# Altium schematic sheet TTL_TO_RS232.SchDoc
size A4
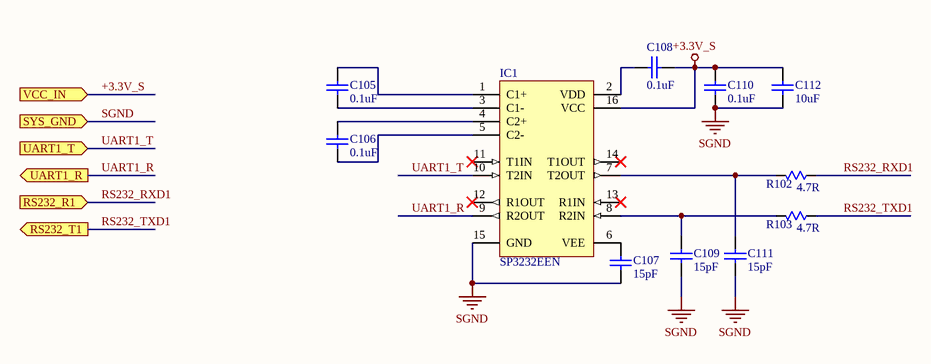
[diagram p0: TTL_TO_RS232.SchDoc]

## Parts
C105  0.1uF  [C0805]
C106  0.1uF  [C0805]
C107  15pF  [C0805]
C108  0.1uF  [C0805]
C109  15pF  [C0805]
C110  0.1uF  [C0805]
C111  15pF  [C0805]
C112  10uF  [C1206]
IC1  SP3232EEN  [SO16-150]
R102  4.7R  [R0805]
R103  4.7R  [R0805]

## Ports
RS232_R1 (in), RS232_T1 (out), SYS_GND (in), UART1_R (out), UART1_T (in), VCC_IN

## Nets
+3.3V_S: C108.1 C110.2 C112.2 IC1.16(VCC) ; port VCC_IN
SGND: C107.2 C109.2 C110.1 C111.2 C112.1 IC1.15(GND) ; port SYS_GND
RS232_RXD1: R102.2 ; port RS232_R1
RS232_TXD1: R103.2 ; port RS232_T1
UART1_R: IC1.9(R2OUT) ; port UART1_R
UART1_T: IC1.10(T2IN) ; port UART1_T
NetC105_1: C105.1 IC1.3(C1-)
NetC105_2: C105.2 IC1.1(C1+)
NetC106_1: C106.1 IC1.5(C2-)
NetC106_2: C106.2 IC1.4(C2+)
NetC107_1: C107.1 IC1.6(VEE)
NetC108_2: C108.2 IC1.2(VDD)
NetC109_1: C109.1 IC1.8(R2IN) R103.1
NetC111_1: C111.1 IC1.7(T2OUT) R102.1

Not connected (* = marked no-connect by the designer): IC1 11(T1IN)* 12(R1OUT)* 13(R1IN)* 14(T1OUT)*

## Library data of the parts
C105 C106 C108 C110 C112 = CAP: Published: 8-Jun-2000; LatestRevisionDate: 17-Jul-2002; LatestRevisionNote: Re-released for DXP Platform.; PackageReference: RAD-0.3; Publisher: Altium Limited
  C105 C106 C108 C110: Value: 0.1uF
  C112: Value: 10uF
C107 C109 C111 = Cap: Capacitor; Published: 8-Jun-2000; Revision: July-2002: Re-released for DXP Platform.; Publisher: Altium Limited; Value: 15pF
IC1 = MAX232ACPE: +5V Powered, Multi-Channel RS-232 Driver/Receiver; Manufacturer: Maxim; Class: Communication; SubClass: Transceiver; Published: 16/01/2001; Publisher: Altium Hobart Technology Centre
R102 = RES: Resistor; Published: 8-Jun-2000; LatestRevisionDate: 04-Mar-2005; LatestRevisionNote: PCB Footprint replaced.; PackageReference: J1-0603; Publisher: Altium Limited; Value: 4.7R
R103 = Res: Resistor; Published: 8-Jun-2000; LatestRevisionDate: 04-Mar-2005; LatestRevisionNote: PCB Footprint replaced.; PackageReference: J1-0603; Publisher: Altium Limited; Value: 4.7R